# Altium project pci-reles.PrjPcb
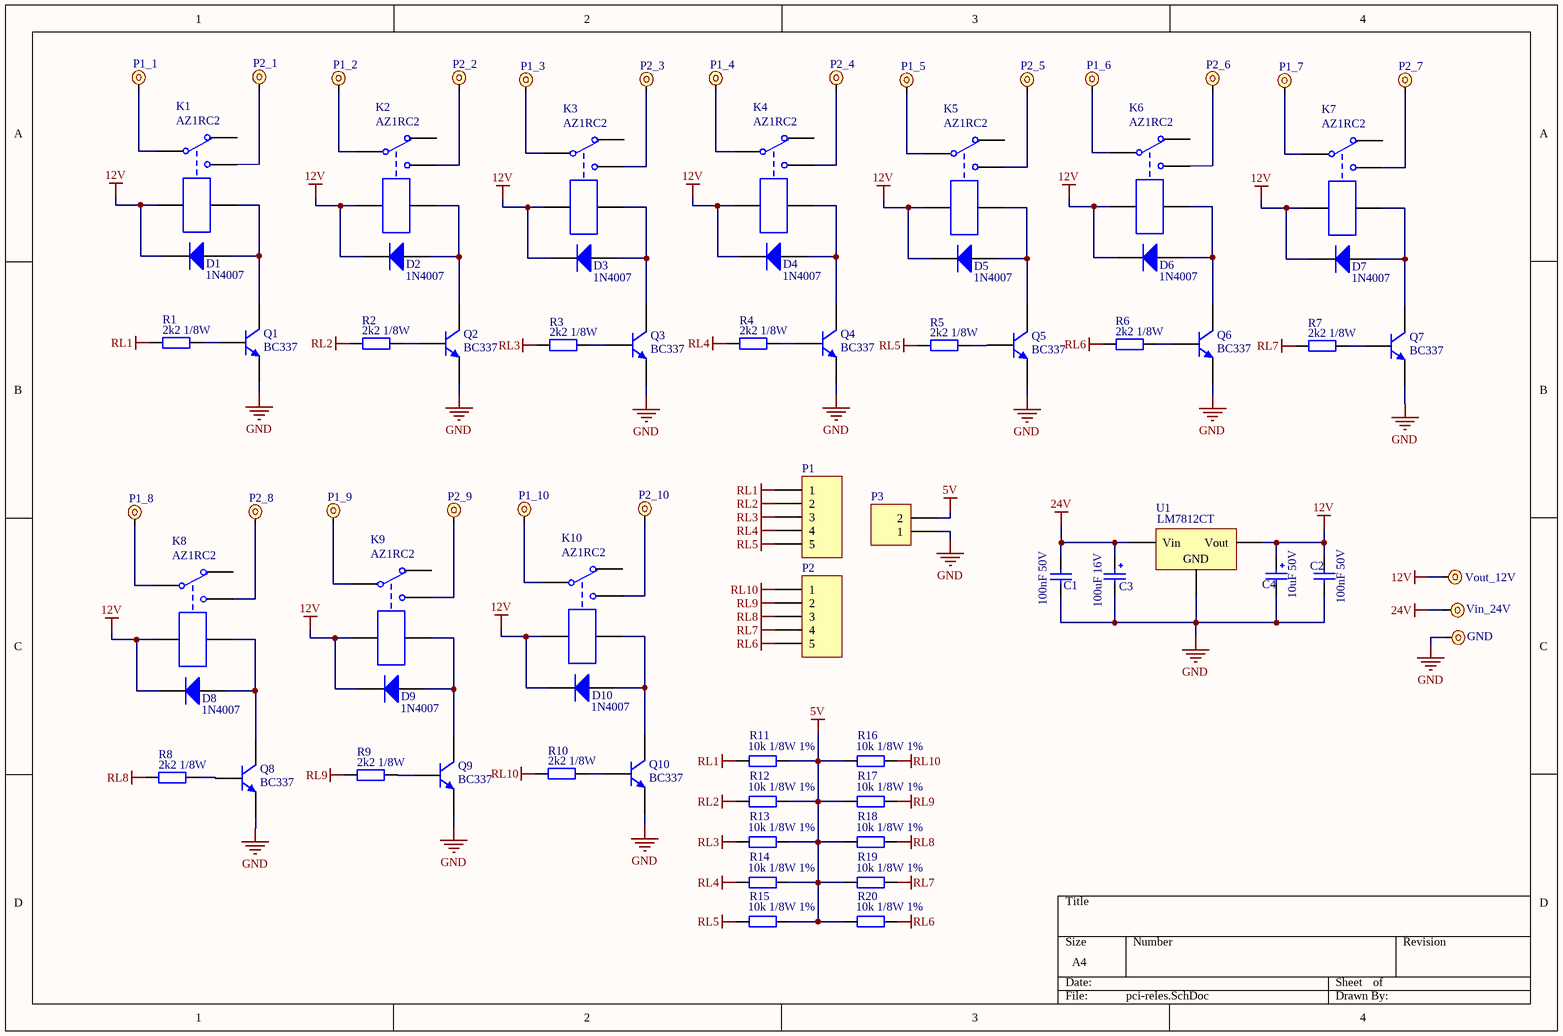
[diagram p0: pci-reles.SchDoc]
1 sheet, 81 parts. Net scope: global (net labels, ports and power ports of the same name join across sheets).
Board file: pci-reles.PcbDoc

## Sheet pci-reles.SchDoc
size A4

### Parts
C1  100nF 50V  [CAP CER 6 x 3 x 5]
C2  100nF 50V  [CAP CER 6 x 3 x 5]
C3  100uF 16V  [CAP ELE 5 x 11 x 2]
C4  10uF 50V  [CAP ELE 5 x 11 x 2]
D1  1N4007  [DO-41]
D2  1N4007  [DO-41]
D3  1N4007  [DO-41]
D4  1N4007  [DO-41]
D5  1N4007  [DO-41]
D6  1N4007  [DO-41]
D7  1N4007  [DO-41]
D8  1N4007  [DO-41]
D9  1N4007  [DO-41]
D10  1N4007  [DO-41]
GND  PAD 1.5x3mm  [PAD 1.5x3mm]  (value not drawn)  (no BOM)
K1  AZ1RC2  [RELE SPDT]
K2  AZ1RC2  [RELE SPDT]
K3  AZ1RC2  [RELE SPDT]
K4  AZ1RC2  [RELE SPDT]
K5  AZ1RC2  [RELE SPDT]
K6  AZ1RC2  [RELE SPDT]
K7  AZ1RC2  [RELE SPDT]
K8  AZ1RC2  [RELE SPDT]
K9  AZ1RC2  [RELE SPDT]
K10  AZ1RC2  [RELE SPDT]
P1  Barra de Pinos RL  [HEADER 5X2.54MM]  (value not drawn)
P1_1  PAD 1.5x3mm  [PAD 1.5x3mm]  (value not drawn)  (no BOM)
P1_2  PAD 1.5x3mm  [PAD 1.5x3mm]  (value not drawn)  (no BOM)
P1_3  PAD 1.5x3mm  [PAD 1.5x3mm]  (value not drawn)  (no BOM)
P1_4  PAD 1.5x3mm  [PAD 1.5x3mm]  (value not drawn)  (no BOM)
P1_5  PAD 1.5x3mm  [PAD 1.5x3mm]  (value not drawn)  (no BOM)
P1_6  PAD 1.5x3mm  [PAD 1.5x3mm]  (value not drawn)  (no BOM)
P1_7  PAD 1.5x3mm  [PAD 1.5x3mm]  (value not drawn)  (no BOM)
P1_8  PAD 1.5x3mm  [PAD 1.5x3mm]  (value not drawn)  (no BOM)
P1_9  PAD 1.5x3mm  [PAD 1.5x3mm]  (value not drawn)  (no BOM)
P1_10  PAD 1.5x3mm  [PAD 1.5x3mm]  (value not drawn)  (no BOM)
P2  Barra de Pinos RL  [HEADER 5X2.54MM]  (value not drawn)
P2_1  PAD 1.5x3mm  [PAD 1.5x3mm]  (value not drawn)  (no BOM)
P2_2  PAD 1.5x3mm  [PAD 1.5x3mm]  (value not drawn)  (no BOM)
P2_3  PAD 1.5x3mm  [PAD 1.5x3mm]  (value not drawn)  (no BOM)
P2_4  PAD 1.5x3mm  [PAD 1.5x3mm]  (value not drawn)  (no BOM)
P2_5  PAD 1.5x3mm  [PAD 1.5x3mm]  (value not drawn)  (no BOM)
P2_6  PAD 1.5x3mm  [PAD 1.5x3mm]  (value not drawn)  (no BOM)
P2_7  PAD 1.5x3mm  [PAD 1.5x3mm]  (value not drawn)  (no BOM)
P2_8  PAD 1.5x3mm  [PAD 1.5x3mm]  (value not drawn)  (no BOM)
P2_9  PAD 1.5x3mm  [PAD 1.5x3mm]  (value not drawn)  (no BOM)
P2_10  PAD 1.5x3mm  [PAD 1.5x3mm]  (value not drawn)  (no BOM)
P3  Barra de Pinos VCC/GND  [HEADER 2X2.54MM]  (value not drawn)
Q1  BC337  [TO-92A]
Q2  BC337  [TO-92A]
Q3  BC337  [TO-92A]
Q4  BC337  [TO-92A]
Q5  BC337  [TO-92A]
Q6  BC337  [TO-92A]
Q7  BC337  [TO-92A]
Q8  BC337  [TO-92A]
Q9  BC337  [TO-92A]
Q10  BC337  [TO-92A]
R1  2k2 1/8W  [RES CR16]
R2  2k2 1/8W  [RES CR16]
R3  2k2 1/8W  [RES CR16]
R4  2k2 1/8W  [RES CR16]
R5  2k2 1/8W  [RES CR16]
R6  2k2 1/8W  [RES CR16]
R7  2k2 1/8W  [RES CR16]
R8  2k2 1/8W  [RES CR16]
R9  2k2 1/8W  [RES CR16]
R10  2k2 1/8W  [RES CR16]
R11  10k 1/8W 1%  [RES CR16]
R12  10k 1/8W 1%  [RES CR16]
R13  10k 1/8W 1%  [RES CR16]
R14  10k 1/8W 1%  [RES CR16]
R15  10k 1/8W 1%  [RES CR16]
R16  10k 1/8W 1%  [RES CR16]
R17  10k 1/8W 1%  [RES CR16]
R18  10k 1/8W 1%  [RES CR16]
R19  10k 1/8W 1%  [RES CR16]
R20  10k 1/8W 1%  [RES CR16]
U1  LM7812CT  [TO220_90]
Vin_24V  PAD 1.5x3mm  [PAD 1.5x3mm]  (value not drawn)  (no BOM)
Vout_12V  PAD 1.5x3mm  [PAD 1.5x3mm]  (value not drawn)  (no BOM)

### Nets
5V: P3.2 R11.2 R12.2 R13.2 R14.2 R15.2 R16.1 R17.1 R18.1 R19.1 R20.1
12V: C2.2 C4.1 D1.2(K) D2.2(K) D3.2(K) D4.2(K) D5.2(K) D6.2(K) D7.2(K) D8.2(K) D9.2(K) D10.2(K) K1.4 K2.4 K3.4 K4.4 K5.4 K6.4 K7.4 K8.4 K9.4 K10.4 U1.3(Vout) Vout_12V.1
24V: C1.2 C3.1 U1.1(Vin) Vin_24V.1
GND: C1.1 C2.1 C3.2 C4.2 GND.1 P3.1 Q1.3(E) Q2.3(E) Q3.3(E) Q4.3(E) Q5.3(E) Q6.3(E) Q7.3(E) Q8.3(E) Q9.3(E) Q10.3(E) U1.2(GND)
RL1: P1.1 R1.1 R11.1
RL2: P1.2 R2.1 R12.1
RL3: P1.3 R3.1 R13.1
RL4: P1.4 R4.1 R14.1
RL5: P1.5 R5.1 R15.1
RL6: P2.5 R6.1 R20.2
RL7: P2.4 R7.1 R19.2
RL8: P2.3 R8.1 R18.2
RL9: P2.2 R9.1 R17.2
RL10: P2.1 R10.1 R16.2
NetD1_1: D1.1(A) K1.5 Q1.1(C)
NetD2_1: D2.1(A) K2.5 Q2.1(C)
NetD3_1: D3.1(A) K3.5 Q3.1(C)
NetD4_1: D4.1(A) K4.5 Q4.1(C)
NetD5_1: D5.1(A) K5.5 Q5.1(C)
NetD6_1: D6.1(A) K6.5 Q6.1(C)
NetD7_1: D7.1(A) K7.5 Q7.1(C)
NetD8_1: D8.1(A) K8.5 Q8.1(C)
NetD9_1: D9.1(A) K9.5 Q9.1(C)
NetD10_1: D10.1(A) K10.5 Q10.1(C)
NetK1_1: K1.1(Comum) P1_1.1
NetK1_2: K1.2(N.A.) P2_1.1
NetK2_1: K2.1(Comum) P1_2.1
NetK2_2: K2.2(N.A.) P2_2.1
NetK3_1: K3.1(Comum) P1_3.1
NetK3_2: K3.2(N.A.) P2_3.1
NetK4_1: K4.1(Comum) P1_4.1
NetK4_2: K4.2(N.A.) P2_4.1
NetK5_1: K5.1(Comum) P1_5.1
NetK5_2: K5.2(N.A.) P2_5.1
NetK6_1: K6.1(Comum) P1_6.1
NetK6_2: K6.2(N.A.) P2_6.1
NetK7_1: K7.1(Comum) P1_7.1
NetK7_2: K7.2(N.A.) P2_7.1
NetK8_1: K8.1(Comum) P1_8.1
NetK8_2: K8.2(N.A.) P2_8.1
NetK9_1: K9.1(Comum) P1_9.1
NetK9_2: K9.2(N.A.) P2_9.1
NetK10_1: K10.1(Comum) P1_10.1
NetK10_2: K10.2(N.A.) P2_10.1
NetQ1_2: Q1.2(B) R1.2
NetQ2_2: Q2.2(B) R2.2
NetQ3_2: Q3.2(B) R3.2
NetQ4_2: Q4.2(B) R4.2
NetQ5_2: Q5.2(B) R5.2
NetQ6_2: Q6.2(B) R6.2
NetQ7_2: Q7.2(B) R7.2
NetQ8_2: Q8.2(B) R8.2
NetQ9_2: Q9.2(B) R9.2
NetQ10_2: Q10.2(B) R10.2

Not connected (* = marked no-connect by the designer): K1 3(N.F.); K2 3(N.F.); K3 3(N.F.); K4 3(N.F.); K5 3(N.F.); K6 3(N.F.); K7 3(N.F.); K8 3(N.F.); K9 3(N.F.); K10 3(N.F.)

### Library data of the parts
C1 C2 = Cap Cerâmico 100nF 50V: CAP CER 0.1UF 50V Y5V RADIAL; Manufacturer: AVX Corporation; Manufacturer Part Number: 5ZH104ZOCAM; Código: 50; Montagem: PTH; Tolerance: -20%, +80%; Temperature Coefficient: Y5V (F); Supplier 1: Digi-Key; Supplier Part Number 1: 478-4279-1-ND; RoHS: RoHS Compliant; Category: Capacitors; Stock 1: 0; Pricing 1: 1=0 (USD); Packaging: Cut Tape (CT); Part Status: Obsolete; Voltage - Rated: 50V; Operating Temperature: -30°C ~ 85°C; Features: -; Ratings: -; Applications: General Purpose; Mounting Type: Through Hole; Package / Case: Radial, Disc; Size / Dimension: 0.236" Dia (6.00mm); Height - Seated (Max): 0.118" (3.00mm); Thickness (Max): -; Lead Spacing: 0.197" (5.00mm); Lead Style: Formed Leads - Kinked; ComponentLink1URL: http://media.digikey.com/pdf/Data%20Sheets/AVX%20PDFs/Disc_Ceram_Cap_Class_III.pdf; ComponentLink1Description: http://media.digikey.com/pdf/Data%20Sheets/AVX%20PDFs/Disc_Ceram_Cap_Class_III.pdf
C3 = Cap Eletrolitico 100uF/16V: CAP ALUM 100UF 20% 16V RADIAL; Manufacturer: Nichicon; Manufacturer Part Number: UFW1C101MDD1TD; Código: 1311; Montagem: PTH; Lifetime @ Temp.: 2000 Hrs @ 85°C; Polarization: Polar; Ripple Current - Low Frequency: 155mA @ 120Hz; Ripple Current - High Frequency: 232.5mA @ 10kHz; Supplier 1: Digi-Key; Supplier Part Number 1: 493-10975-1-ND; RoHS: RoHS Compliant; Category: Capacitors; Stock 1: 17383; Pricing 1: 1=0.23, 10=0.159, 100=0.0903, 500=0.06376, 1000=0.05579 (USD); Packaging: Cut Tape (CT); Part Status: Active; Tolerance: ±20%; ESR (Equivalent Series Resistance): -; Operating Temperature: -40°C ~ 85°C; Applications: Audio; Lead Spacing: 0.079" (2.00mm); Size / Dimension: 0.197" Dia (5.00mm); Height - Seated (Max): 0.492" (12.50mm); Surface Mount Land Size: -; Mounting Type: Through Hole; Package / Case: Radial, Can; ComponentLink1URL: http://nichicon-us.com/english/products/pdfs/e-ufw.pdf; ComponentLink1Description: http://nichicon-us.com/english/products/pdfs/e-ufw.pdf
C4 = Cap Eletrolitico 10uF 400V: CAP ALUM 10UF 20% 400V RADIAL; Manufacturer: Nichicon; Manufacturer Part Number: UVY2G100MPD; Montagem: PTH; Lifetime @ Temp.: 1000 Hrs @ 105°C; Polarization: Polar; Ripple Current - Low Frequency: 64mA @ 120Hz; Ripple Current - High Frequency: 102.4mA @ 10kHz; Código: *; Supplier 1: Digi-Key; Supplier Part Number 1: 493-13411-ND; RoHS: RoHS Compliant; Category: Capacitors; Stock 1: 12533; Pricing 1: 1=0.65, 10=0.462, 100=0.3045, 500=0.22554, 1000=0.19171, 2500=0.18043, 5000=0.16916 (USD); Packaging: Bulk; Part Status: Active; Tolerance: ±20%; ESR (Equivalent Series Resistance): -; Operating Temperature: -40°C ~ 105°C; Applications: General Purpose; Lead Spacing: 0.197" (5.00mm); Size / Dimension: 0.394" Dia (10.00mm); Height - Seated (Max): 0.689" (17.50mm); Surface Mount Land Size: -; Mounting Type: Through Hole; Package / Case: Radial, Can; ComponentLink1URL: http://nichicon-us.com/english/products/pdfs/e-uvy.pdf; ComponentLink1Description: http://nichicon-us.com/english/products/pdfs/e-uvy.pdf
D1-D10 = Diodo 1N4007: DIODE GEN PURP 1KV 1A DO41; Manufacturer: Diodes Incorporated; Manufacturer Part Number: 1N4007G-T; Código: 2; Montagem: PTH; Diode Type: Standard; Voltage - Forward (Vf) (Max) @ If: 1V @ 1A; Speed: Standard Recovery >500ns, > 200mA (Io); Current - Reverse Leakage @ Vr: 5µA @ 1000V; Capacitance @ Vr, F: 8pF @ 4V, 1MHz; Supplier 1: Digi-Key; Supplier Part Number 1: 1N4007GDICT-ND; RoHS: RoHS Compliant; Category: Discrete Semiconductor Products; Stock 1: 46214; Pricing 1: 1=0.4, 10=0.299, 100=0.1694, 500=0.11216, 1000=0.08599 (USD); Packaging: Cut Tape (CT); Part Status: Active; Current - Average Rectified (Io): 1A; Mounting Type: Through Hole; Package / Case: DO-204AL, DO-41, Axial; Supplier Device Package: DO-41; Operating Temperature - Junction: -65°C ~ 175°C; ComponentLink1URL: https://www.diodes.com/assets/Datasheets/ds29002.pdf; ComponentLink1Description: https://www.diodes.com/assets/Datasheets/ds29002.pdf; Supplier 2: Digi-Key; Supplier Part Number 2: RGP30K-E3/73-ND; Stock 2: 0; Pricing 2: 2000=0.38779 (USD); Base Part Number: RGP30K; ComponentLink2URL: http://www.vishay.com/docs/88704/rgp30a.pdf; ComponentLink2Description: http://www.vishay.com/docs/88704/rgp30a.pdf
GND P1_1-P1_10 P2_1-P2_10 Vin_24V Vout_12V = PAD 1.5x3mm: PAD
K1-K10 = Rele AZ1RC2: RELAY GEN PURPOSE SPDT 10A 12V; Manufacturer: Metaltex; Relay Type: General Purpose; Coil Type: Non Latching; Coil Voltage: 12VDC; Contact Form: SPDT (1 Form C); Switching Voltage: 250VAC, 30VDC - Max; Turn On Voltage (Max): 9 VDC; Turn Off Voltage (Min): 1.2 VDC; Coil Power: 360 mW; Coil Resistance: 400 Ohms; Montagem: PTH; Código: 2567; Supplier 1: Digi-Key; Supplier Part Number 1: Z1012-ND; Manufacturer Part Number: AZ1RC2; RoHS: RoHS Compliant; Category: Relays; Stock 1: 37370; Pricing 1: 1=1.33, 10=1.247, 25=1.108, 50=1.0526, 100=0.9972, 250=0.8864, 500=0.831 (USD); Packaging: Tray; Part Status: Active; Mounting Type: Through Hole; Termination Style: PC Pin; Contact Material: Silver Tin Oxide (AgSnO); Operating Temperature: -40°C ~ 85°C; ComponentLink1URL: http://www.metaltex.com.br/downloads/AZ.pdf; ComponentLink1Description: http://www.metaltex.com.br/downloads/AZ.pdf
P1 P2 = Barra de pinos simples 180°, 5 pinos: CONN HEADER 5 POS 2.54; Manufacturer: Metaltex; Manufacturer Part Number: BPSC-5; Pitch - Mating: 0.100" (2.54mm); Style: Board to Board or Cable; Shrouding: Unshrouded; Number of Positions: 5; Number of Positions Loaded: All; Contact Length - Mating: 0.236" (6.00mm); Contact Length - Post: 0.118" (3.00mm); Overall Contact Length: 0.454" (11.54mm); Material Flammability Rating: UL94 V-0; Current Rating: 1A; Voltage Rating: 250V; Código: 2309; Montagem: PTH; Supplier 1: Digi-Key; Supplier Part Number 1: 732-5318-ND; RoHS: RoHS Compliant; Category: Connectors, Interconnects; Stock 1: 5437; Pricing 1: 1=0.25, 10=0.209, 25=0.174, 50=0.145, 100=0.132, 1000=0.12 (USD); Packaging: Bulk; Part Status: Active; Connector Type: Header; Contact Type: Male Pin; Number of Rows: 1; Row Spacing - Mating: -; Mounting Type: Through Hole; Termination: Solder; Fastening Type: -; Insulation Height: 0.100" (2.54mm); Contact Shape: Square; Contact Finish - Mating: Gold; Contact Finish Thickness - Mating: -; Contact Finish - Post: -; Contact Material: Copper Alloy; Insulation Material: Polybutylene Terephthalate (PBT); Features: -; Operating Temperature: -40°C ~ 125°C; Ingress Protection: -; Insulation Color: Black; Mated Stacking Heights: -; Contact Finish Thickness - Post: -; Applications: -; ComponentLink1URL: http://www.metaltex.com.br/produtos/componentes/4091/conectores_para_pci/4094/bp_barra_de_pinos; ComponentLink1Description: http://www.metaltex.com.br/produtos/componentes/4091/conectores_para_pci/4094/bp_barra_de_pinos
P3 = Barra de pinos simples 180°, 2 pinos: CONN HEADER 2 POS 2.54; Manufacturer: Metaltex; Manufacturer Part Number: BPSC-2; Código: 2306; Montagem: PTH; Pitch - Mating: 0.100" (2.54mm); Style: Board to Board or Cable; Shrouding: Unshrouded; Number of Positions: 2; Number of Positions Loaded: All; Contact Length - Mating: 0.236" (6.00mm); Contact Length - Post: 0.118" (3.00mm); Overall Contact Length: 0.454" (11.54mm); Material Flammability Rating: UL94 V-0; Current Rating: 3A; Voltage Rating: 250V; Supplier 1: Digi-Key; Supplier Part Number 1: 732-5315-ND; RoHS: RoHS Compliant; Category: Connectors, Interconnects; Stock 1: 2640; Pricing 1: 1=0.18, 10=0.153, 25=0.1272, 50=0.106, 100=0.096, 1000=0.088 (USD); Packaging: Bulk; Part Status: Active; Connector Type: Header; Contact Type: Male Pin; Number of Rows: 1; Row Spacing - Mating: -; Mounting Type: Through Hole; Termination: Solder; Fastening Type: Push-Pull; Insulation Height: 0.100" (2.54mm); Contact Shape: Square; Contact Finish - Mating: Gold; Contact Finish Thickness - Mating: -; Contact Finish - Post: -; Contact Material: Copper Alloy; Insulation Material: Polybutylene Terephthalate (PBT); Features: -; Operating Temperature: -40°C ~ 125°C; Ingress Protection: -; Insulation Color: Black; Mated Stacking Heights: -; Contact Finish Thickness - Post: -; Applications: -; ComponentLink1URL: http://www.metaltex.com.br/produtos/componentes/4091/conectores_para_pci/4094/bp_barra_de_pinos; ComponentLink1Description: http://www.metaltex.com.br/produtos/componentes/4091/conectores_para_pci/4094/bp_barra_de_pinos
Q1-Q10 = Transistor NPN BC337-40: TRANS NPN 45V 0.8A TO-92; Manufacturer: ON Semiconductor; Manufacturer Part Number: BC33740TA; Montagem: PTH; Código: 1679; Vce Saturation (Max) @ Ib, Ic: 700mV @ 50mA, 500mA; Current - Collector Cutoff (Max): 100nA; DC Current Gain (hFE) (Min) @ Ic, Vce: 250 @ 100mA, 1V; Frequency - Transition: 100MHz; Supplier 1: Digi-Key; Supplier Part Number 1: BC33740TACT-ND; RoHS: RoHS Compliant; Category: Discrete Semiconductor Products; Stock 1: 25859; Pricing 1: 1=0.23, 10=0.19, 100=0.1005, 500=0.06612, 1000=0.04496 (USD); Packaging: Cut Tape (CT); Part Status: Active; Transistor Type: NPN; Operating Temperature: 150°C (TJ); Mounting Type: Through Hole; Package / Case: TO-226-3, TO-92-3 (TO-226AA) (Formed Leads); Supplier Device Package: TO-92-3; ComponentLink1URL: https://www.fairchildsemi.com/datasheets/BC/BC337.pdf; ComponentLink1Description: https://www.fairchildsemi.com/datasheets/BC/BC337.pdf
R1-R10 = Res 2k2 1/8W 5% CR16: RES 2K2 OHM 1/8W 5% AXIAL; Manufacturer: Stackpole Electronics Inc.; Manufacturer Part Number: CF18JT2K20; Montagem: PTH; Código: 403; Power (Watts): 0.125W, 1/8W; Temperature Coefficient: 0/ -400ppm/°C; Supplier 1: Digi-Key; Supplier Part Number 1: CF18JT2K20CT-ND; RoHS: RoHS Compliant; Category: Resistors; Stock 1: 184779; Pricing 1: 1=0.1, 10=0.049, 25=0.036, 50=0.0272, 100=0.0201, 250=0.01536, 500=0.01228, 1000=0.00904 (USD); Packaging: Cut Tape (CT); Part Status: Active; Tolerance: ±5%; Composition: Carbon Film; Features: Flame Retardant Coating, Safety; Operating Temperature: -55°C ~ 155°C; Package / Case: Axial; Supplier Device Package: Axial; Size / Dimension: 0.067" Dia x 0.130" L (1.70mm x 3.30mm); Height - Seated (Max): -; Failure Rate: -; ComponentLink1URL: https://www.seielect.com/Catalog/SEI-CF_CFM.pdf; ComponentLink1Description: https://www.seielect.com/Catalog/SEI-CF_CFM.pdf
R11-R20 = Res 10k 1/8W 1% CR16: RES 10K OHM 1/8W 1% AXIAL; Manufacturer: Stackpole Electronics Inc.; Manufacturer Part Number: RNF18FTD10K0; Montagem: PTH; Código: 1472; Power (Watts): 0.125W, 1/8W; Temperature Coefficient: ±100ppm/°C; Supplier 1: Digi-Key; Supplier Part Number 1: RNF18FTD10K0CT-ND; RoHS: RoHS Compliant; Category: Resistors; Stock 1: 272706; Pricing 1: 1=0.1, 10=0.072, 25=0.0496, 50=0.0386, 100=0.0275, 250=0.02144, 500=0.01706, 1000=0.0121 (USD); Packaging: Cut Tape (CT); Part Status: Active; Tolerance: ±1%; Composition: Metal Film; Features: Flame Retardant Coating, Safety; Operating Temperature: -55°C ~ 155°C; Package / Case: Axial; Supplier Device Package: Axial; Size / Dimension: 0.071" Dia x 0.130" L (1.80mm x 3.30mm); Height - Seated (Max): -; Failure Rate: -; ComponentLink1URL: https://www.seielect.com/Catalog/SEI-RNF_RNMF.pdf; ComponentLink1Description: https://www.seielect.com/Catalog/SEI-RNF_RNMF.pdf
U1 = Regulador de tensão LM7805CT: IC REG LINEAR 5V 1A TO220-3; Manufacturer: Texas Instruments; Manufacturer Part Number: LM7805CT/NOPB; Código: 329; Montagem: PTH; Output Configuration: Positive; Output Type: Fixed; Voltage - Input (Max): 35V; Voltage Dropout (Max): 2V @ 1A; PSRR: 80dB (120Hz); Protection Features: Over Current, Over Temperature, Short Circuit; Supplier 1: Digi-Key; Supplier Part Number 1: 296-47192-ND; RoHS: RoHS Compliant; Category: Integrated Circuits (ICs); Stock 1: 304; Pricing 1: 1=1.54, 10=1.381, 100=1.1097, 500=0.91176, 1000=0.75545 (USD); Packaging: Tube; Part Status: Active; Voltage - Output (Min/Fixed): 5V; Voltage - Output (Max): -; Current - Output: 1A; Control Features: -; Operating Temperature: 0°C ~ 125°C; Mounting Type: Through Hole; Package / Case: TO-220-3; Supplier Device Package: TO-220-3; ComponentLink1URL: http://www.ti.com/lit/ds/symlink/lm340.pdf; ComponentLink1Description: http://www.ti.com/lit/ds/symlink/lm340.pdf